# Altium schematic sheet Servo_sens.SchDoc
size A
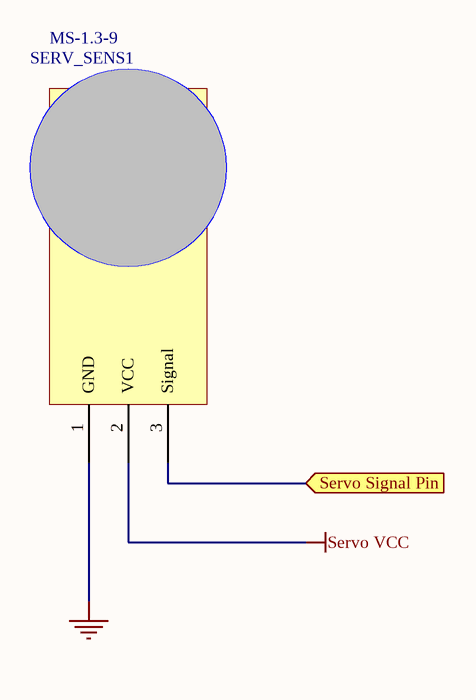
[diagram p0: Servo_sens.SchDoc]

## Parts
SERV_SENS1  MS-1.3-9

## Ports
Servo Signal Pin (in)

## Nets
GND: SERV_SENS1.1(GND)
Servo VCC: SERV_SENS1.2(VCC)
Servo Signal Pin: SERV_SENS1.3(Signal) ; port Servo Signal Pin

## Library data of the parts
SERV_SENS1 = Servo